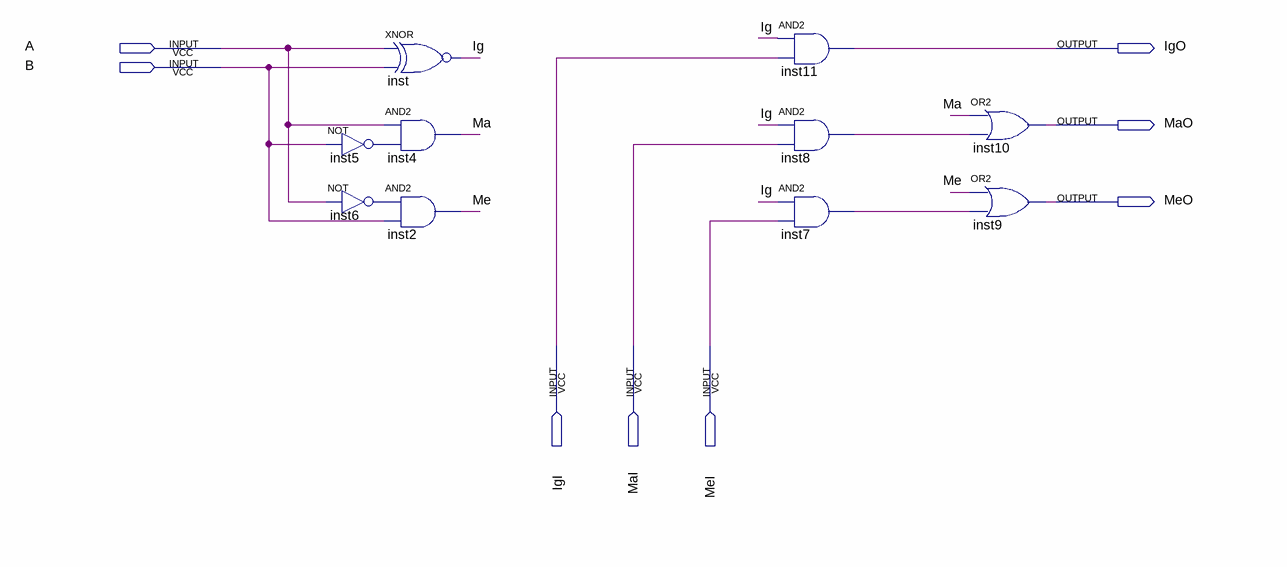
[diagram p0: schematic sheet]
// Quartus schematic ParteComparador.bdf as structural Verilog: 10 symbols, 8 pins
module ParteComparador (
  input  A,
  input  B,
  input  IgI,
  input  MaI,
  input  MeI,
  output IgO,
  output MaO,
  output MeO
);

  wire Ig, inst5_out, inst6_out, inst7_out, inst8_out, Ma, Me;

  not inst5 (inst5_out, B);
  not inst6 (inst6_out, A);
  xnor inst (Ig, A, B);
  and inst4 (Ma, A, inst5_out);
  and inst2 (Me, inst6_out, B);
  and inst11 (IgO, Ig, IgI);
  and inst8 (inst8_out, Ig, MaI);
  and inst7 (inst7_out, Ig, MeI);
  or inst10 (MaO, Ma, inst8_out);
  or inst9 (MeO, Me, inst7_out);
endmodule
